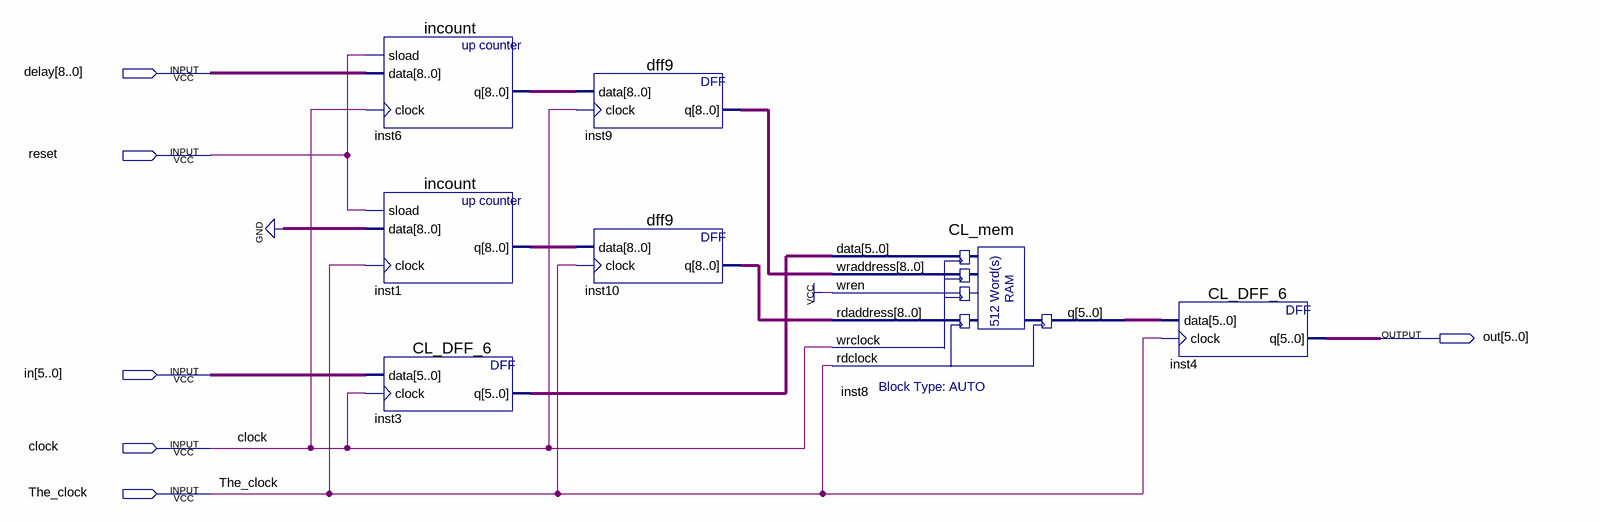
[diagram p0: schematic sheet]
// Quartus schematic CL_Basic_DAQ_Block_trigg.bdf as structural Verilog: 7 symbols, 6 pins
module CL_Basic_DAQ_Block_trigg (
  input  [8:0] delay,
  input  reset,
  input  [5:0] in,
  input  clock,
  input  The_clock,
  output [5:0] out
);

  wire [5:0] inst3_q, inst8_q;
  wire [8:0] inst1_q, inst6_q, inst9_q, inst10_q;

  incount inst6 (.sload(reset), .data(delay), .clock(clock), .q(inst6_q));
  incount inst1 (.sload(reset), .data({9{1'b0}}), .clock(The_clock), .q(inst1_q));
  CL_DFF_6 inst3 (.data(in), .clock(clock), .q(inst3_q));
  dff9 inst9 (.data(inst6_q), .clock(clock), .q(inst9_q));
  dff9 inst10 (.data(inst1_q), .clock(The_clock), .q(inst10_q));
  CL_mem inst8 (
    .data(inst3_q), .wraddress(inst9_q), .wren(1'b1), .rdaddress(inst10_q), .wrclock(clock),
    .rdclock(The_clock), .q(inst8_q));
  CL_DFF_6 inst4 (.data(inst8_q), .clock(The_clock), .q(out));
endmodule
